# Altium schematic sheet MAX96724_PINOUT.SchDoc
size D; SheetNumber: 3; SheetTotal: 19
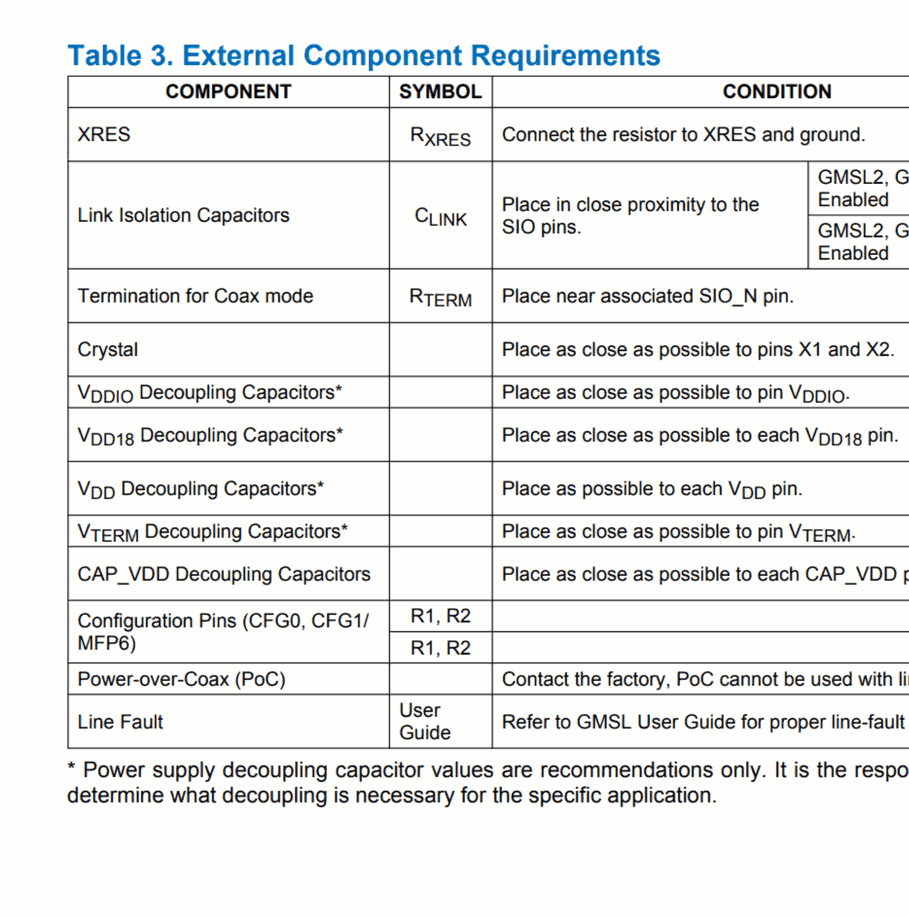
[diagram p0: MAX96724_PINOUT.SchDoc, top left]
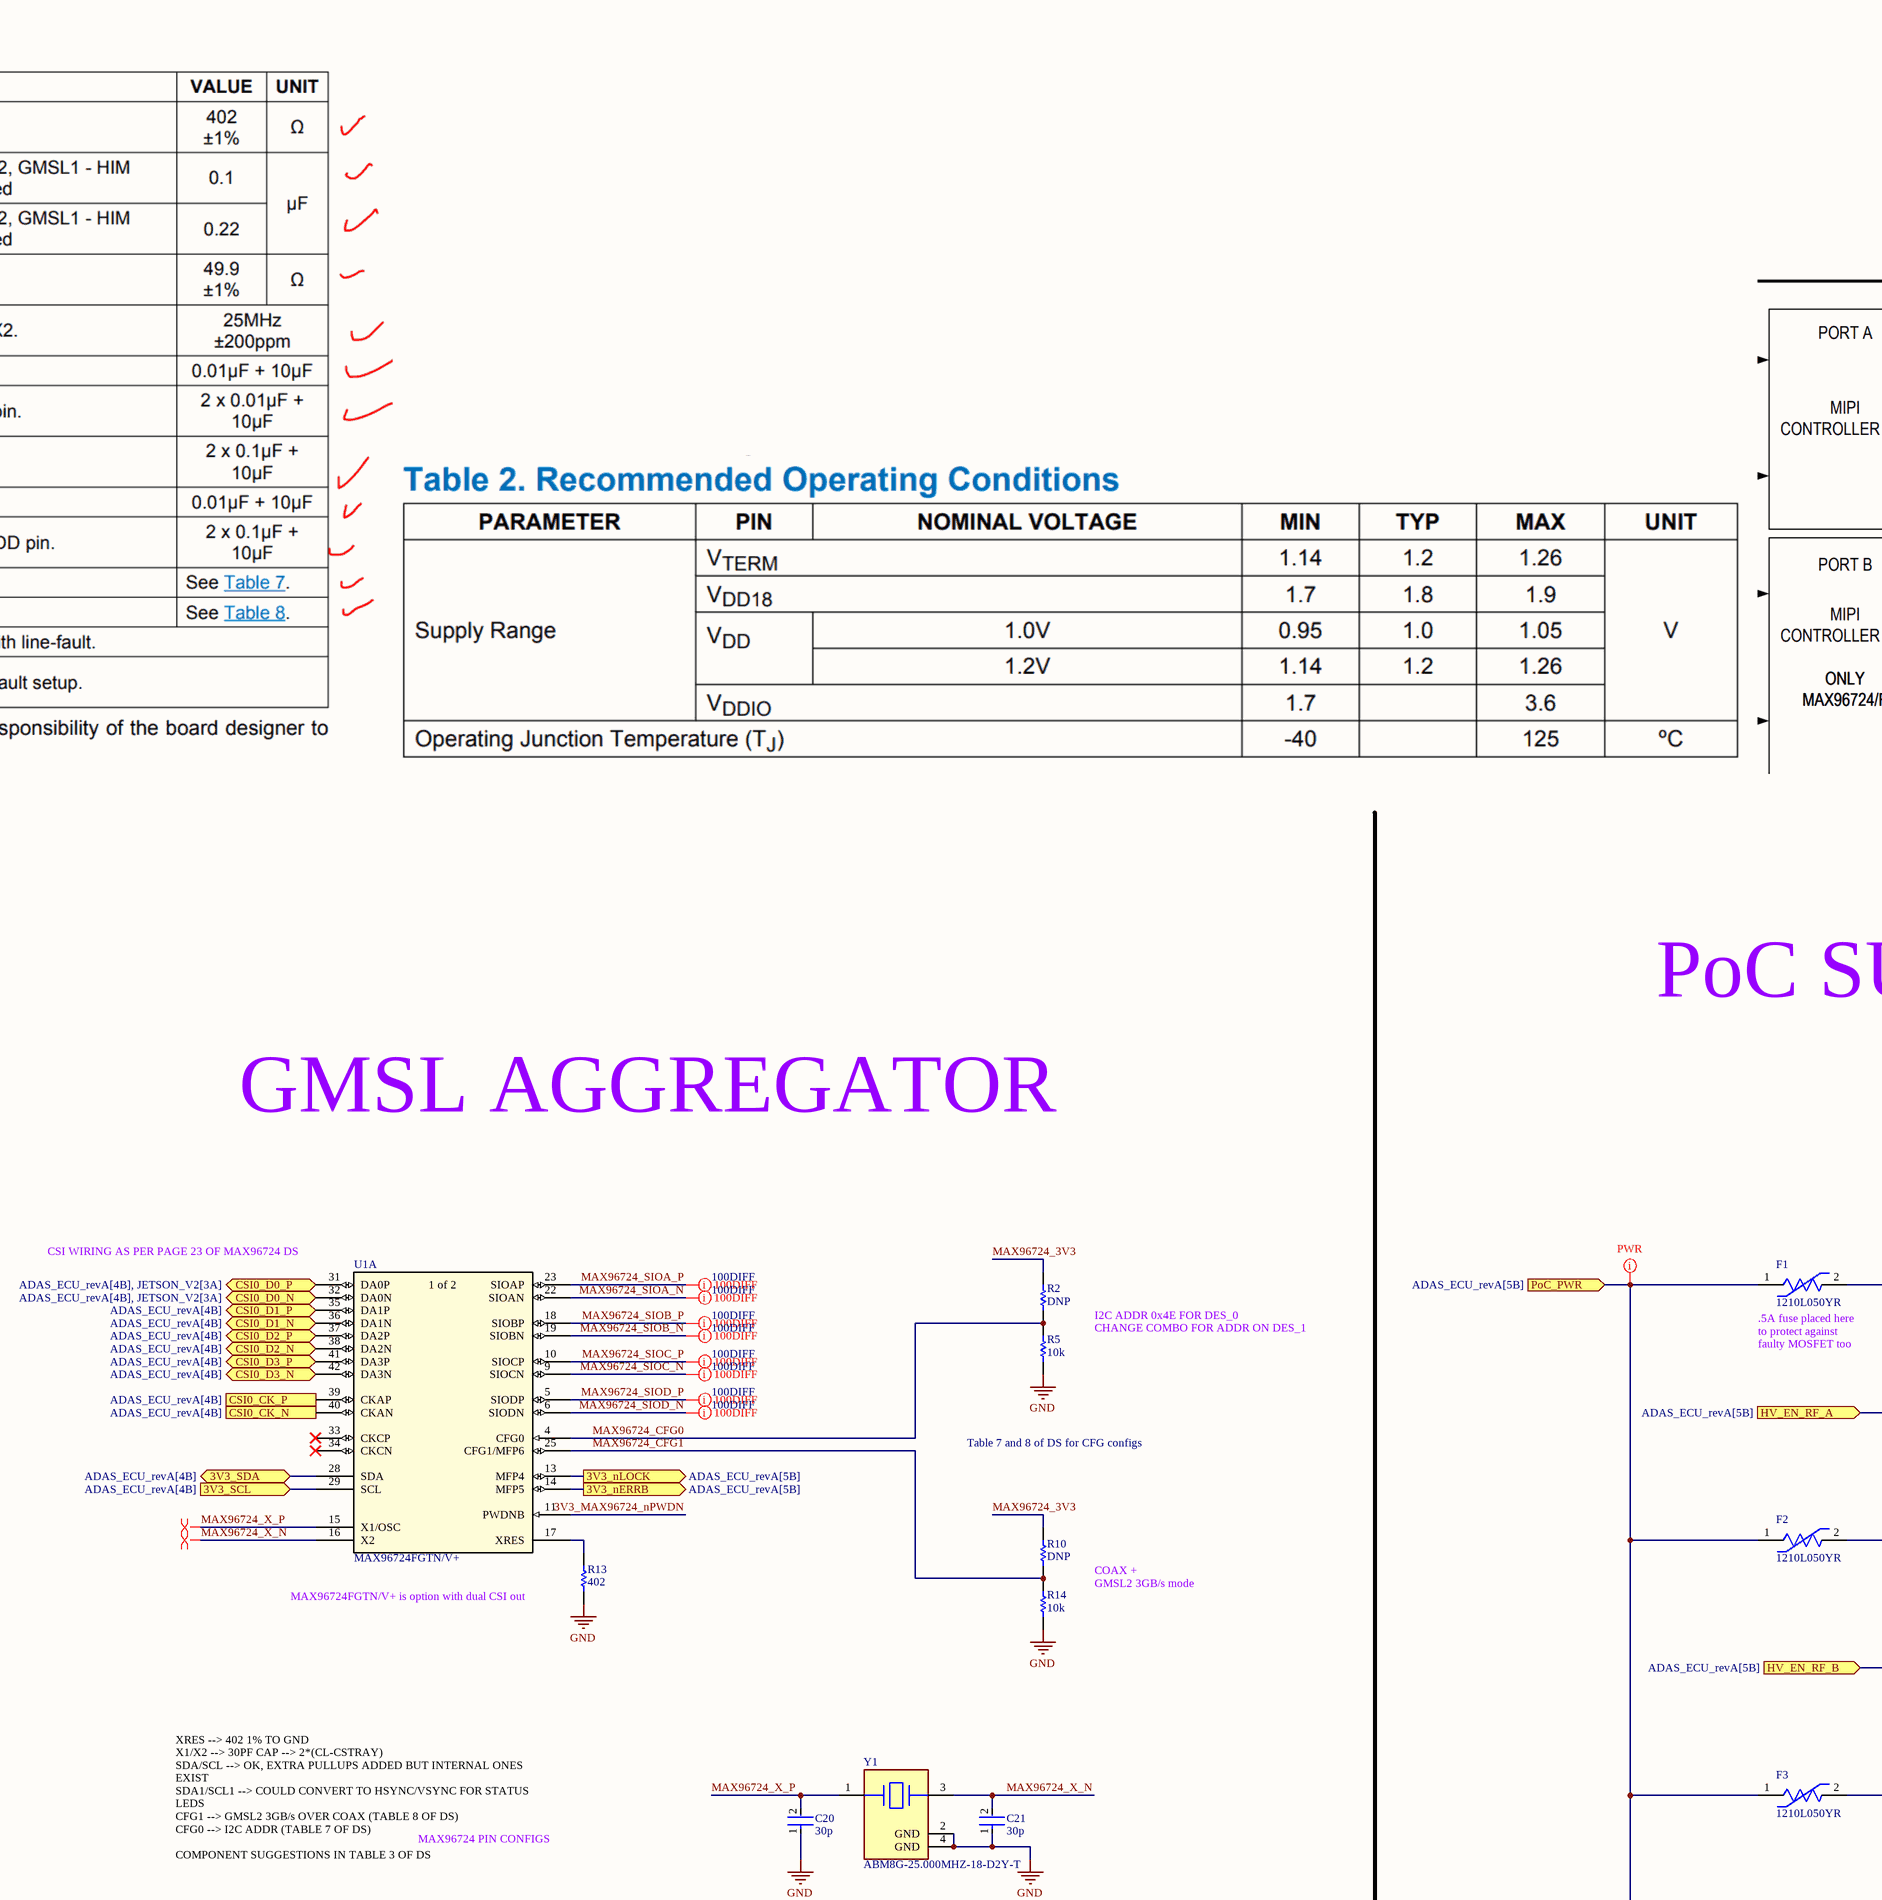
[diagram p1: MAX96724_PINOUT.SchDoc, top middle]
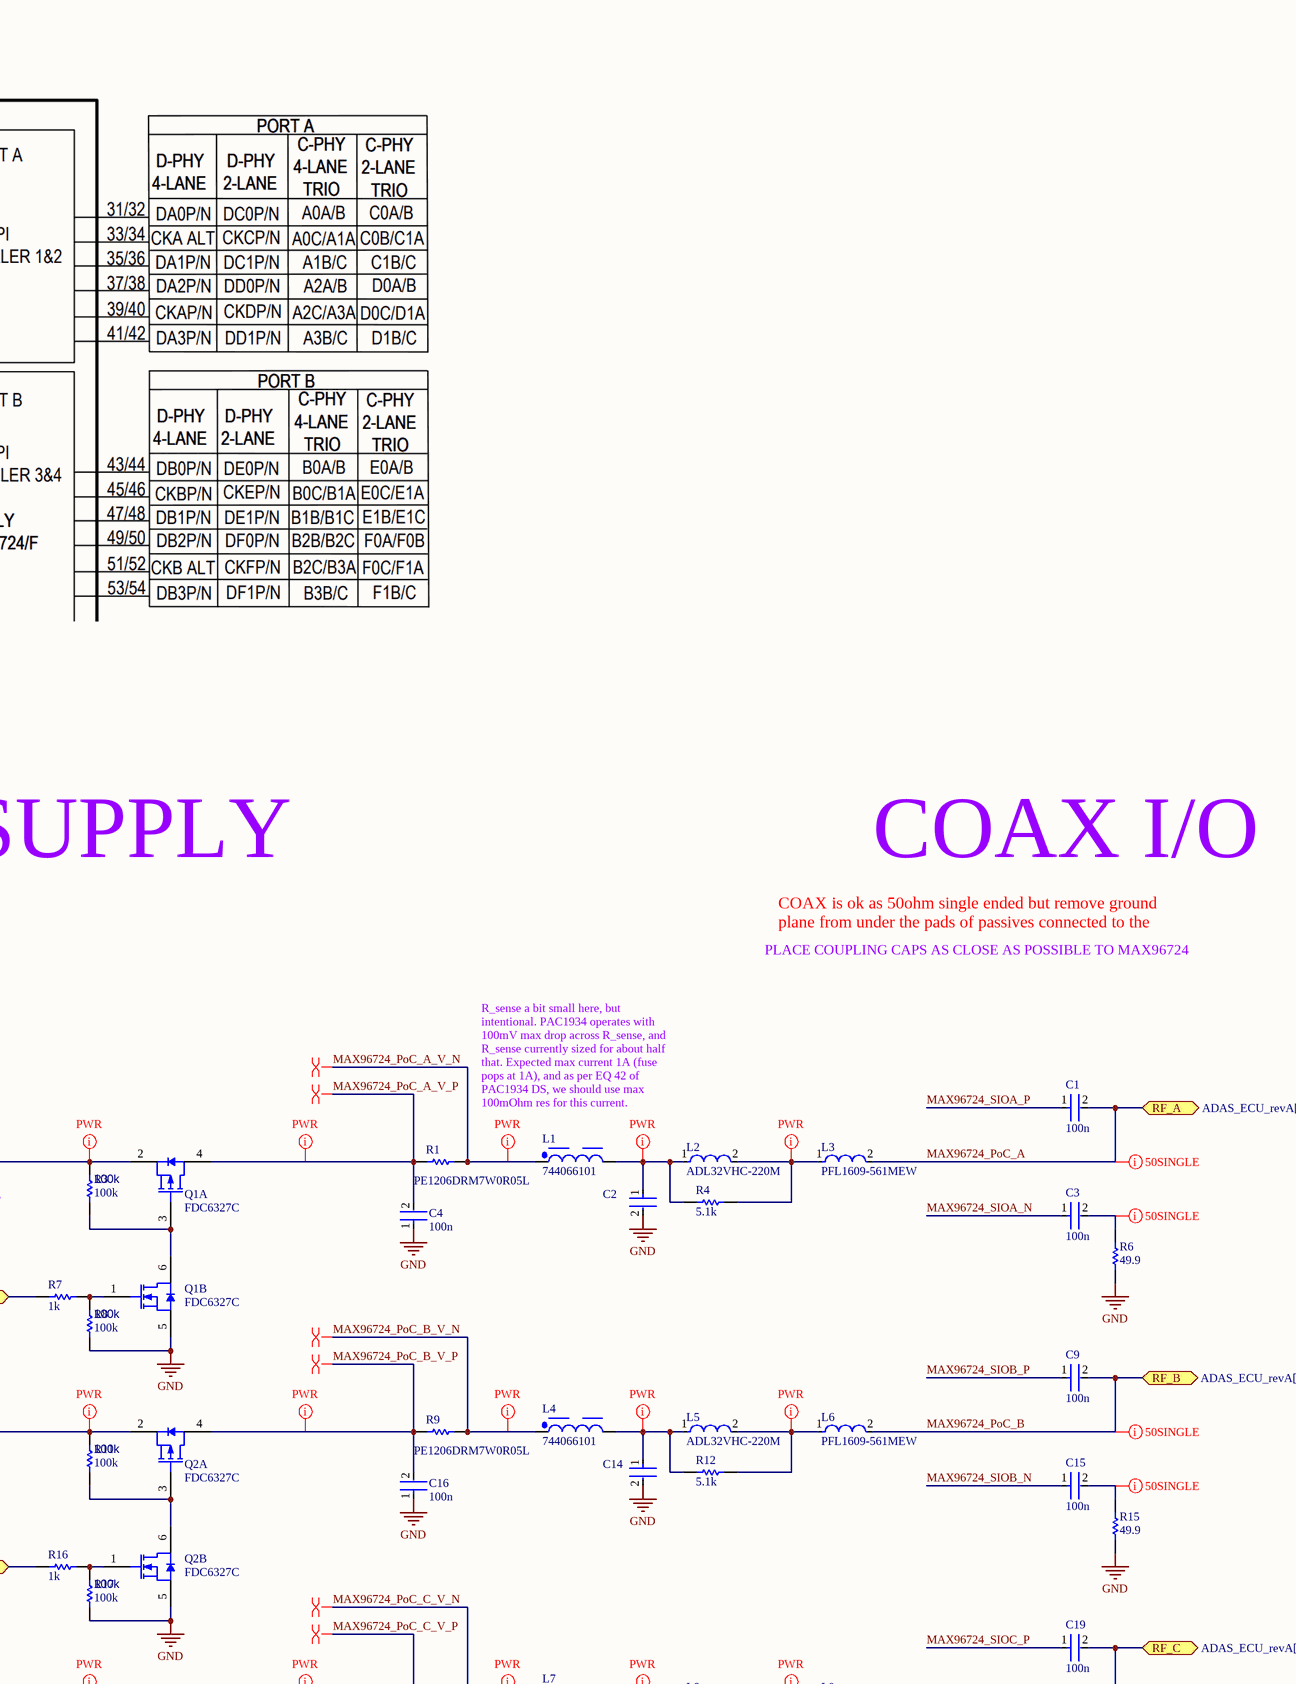
[diagram p2: MAX96724_PINOUT.SchDoc, top right]
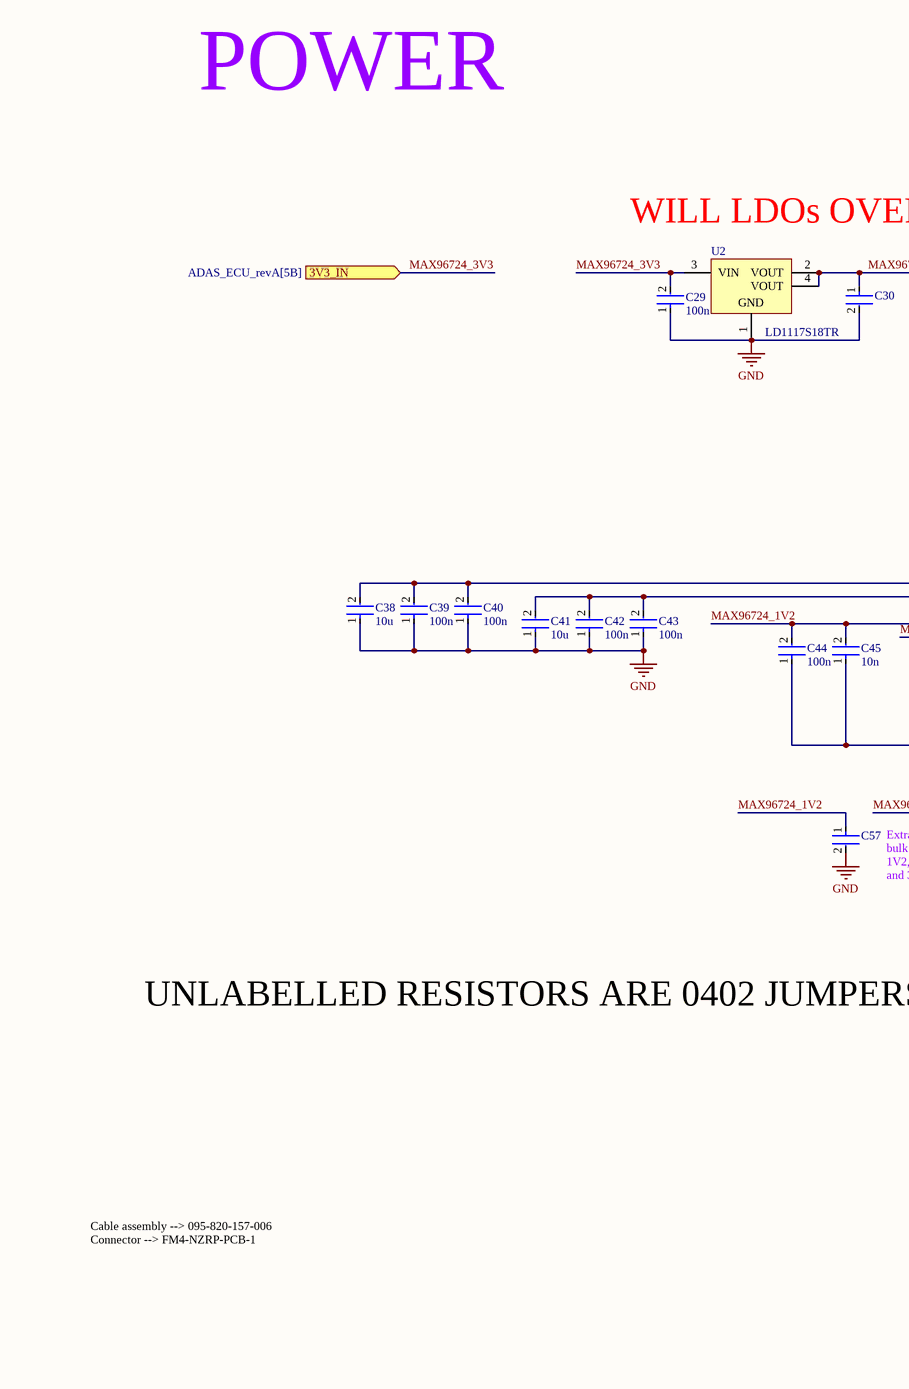
[diagram p3: MAX96724_PINOUT.SchDoc, bottom left]
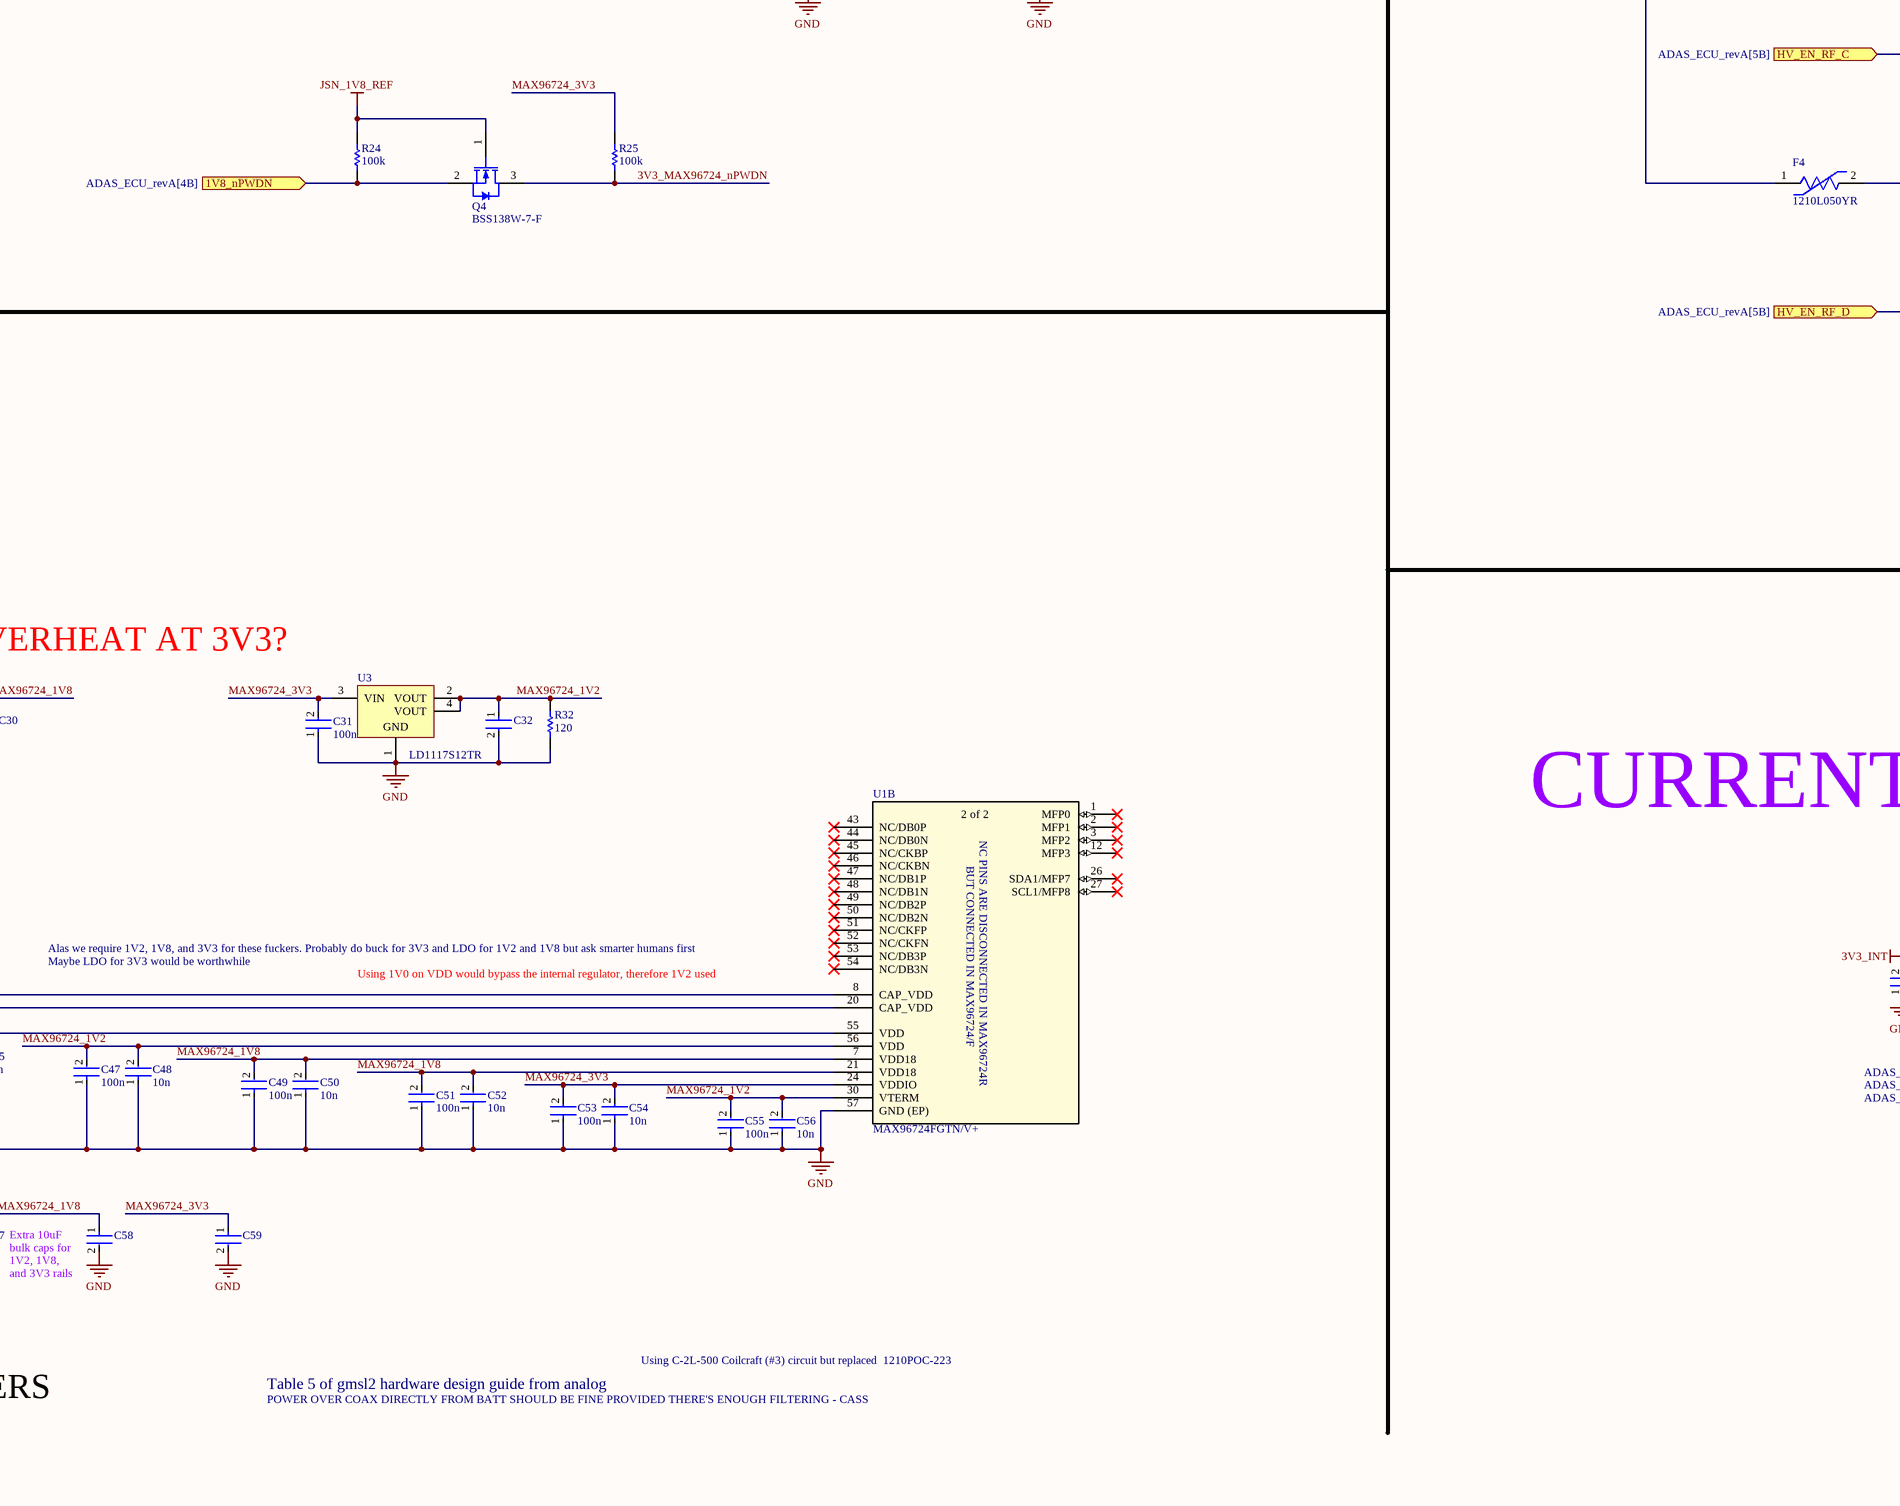
[diagram p4: MAX96724_PINOUT.SchDoc, bottom middle]
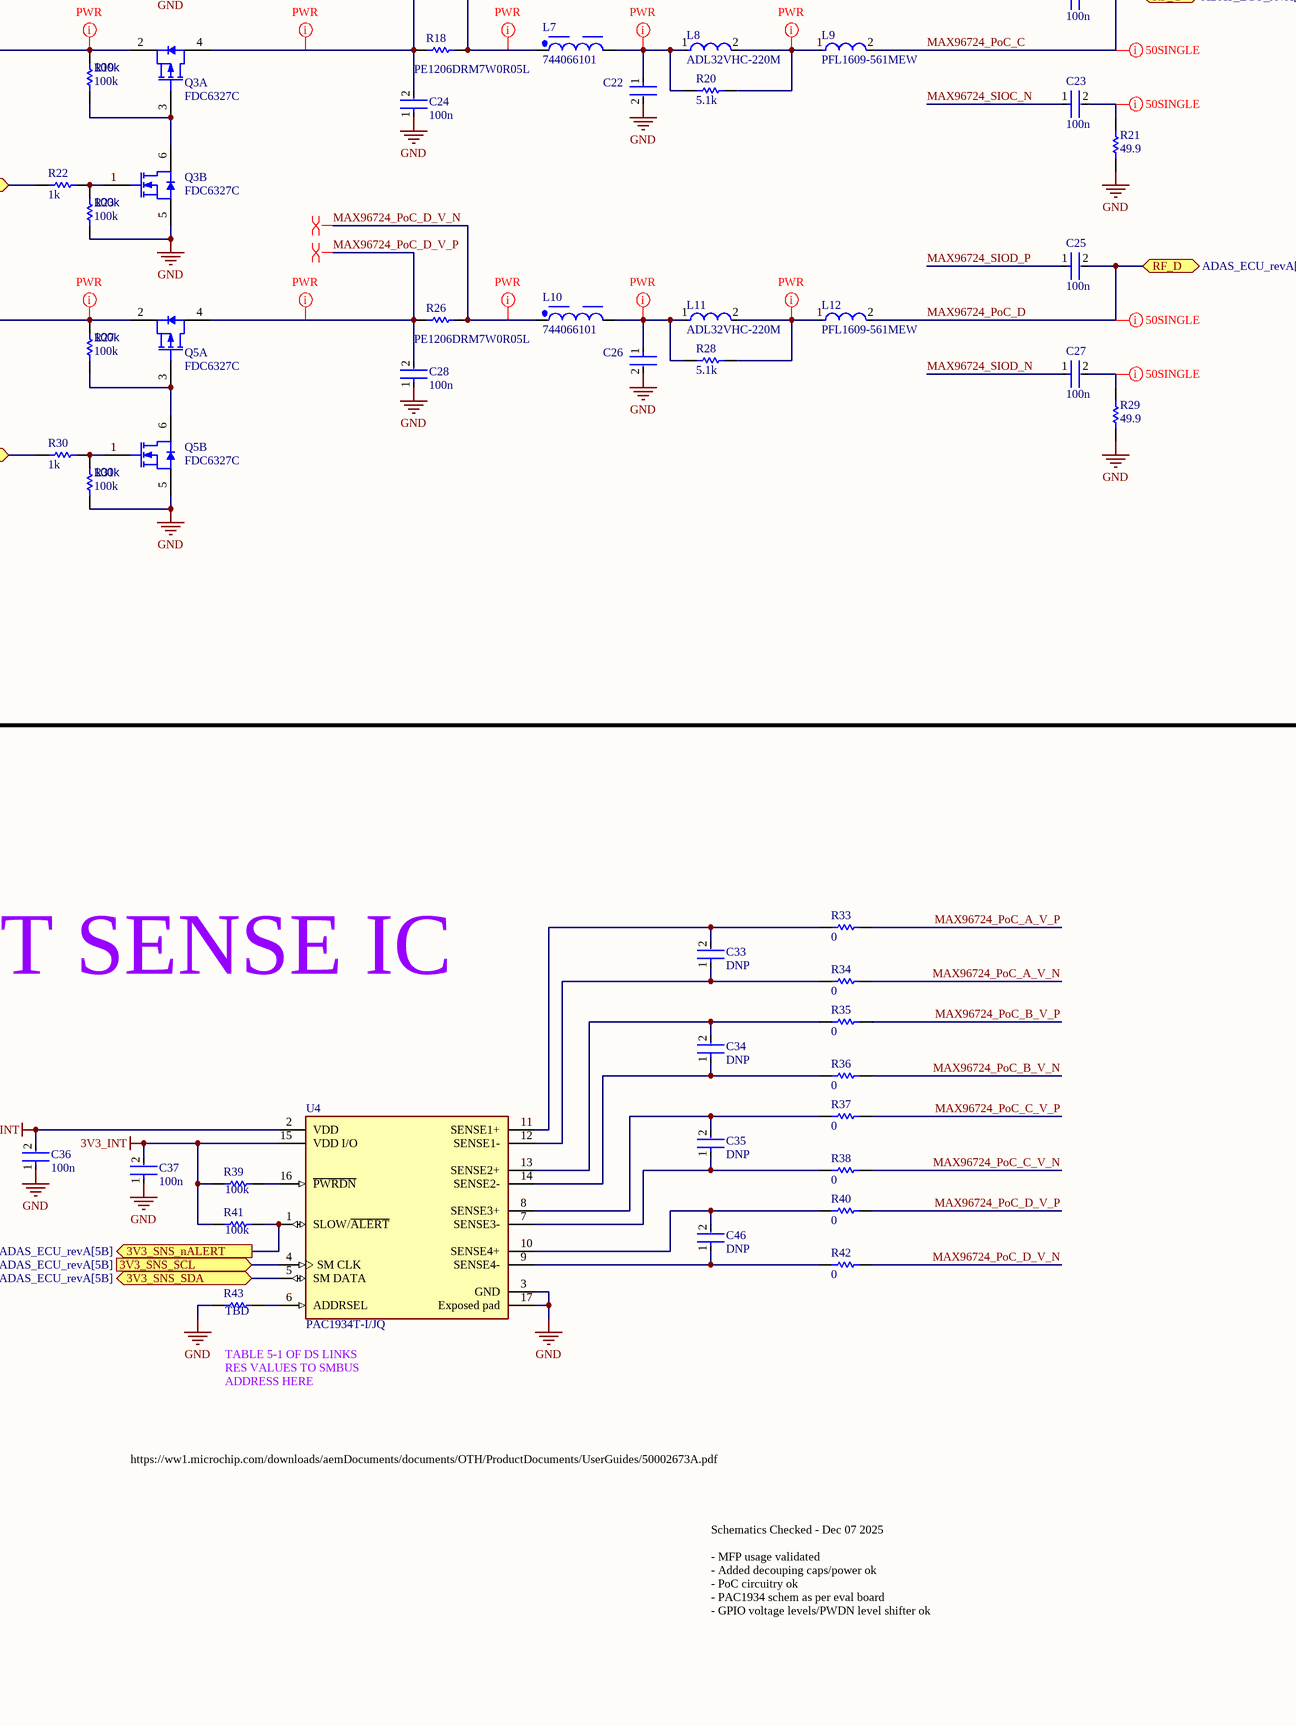
[diagram p5: MAX96724_PINOUT.SchDoc, bottom right]

## Parts
C1  100n  [FP-0402-L_1_0_0_05-W_0_5-IPC_A]
C2  GRM21BR61E226ME44L  [FP-GRM21B-0_2-e0_2_0_7-IPC_B]  (value not drawn)
C3  100n  [FP-0402-L_1_0_0_05-W_0_5-IPC_A]
C4  100n  [FP-0402-L_1_0_0_05-W_0_5-IPC_A]
C9  100n  [FP-0402-L_1_0_0_05-W_0_5-IPC_A]
C14  GRM21BR61E226ME44L  [FP-GRM21B-0_2-e0_2_0_7-IPC_B]  (value not drawn)
C15  100n  [FP-0402-L_1_0_0_05-W_0_5-IPC_A]
C16  100n  [FP-0402-L_1_0_0_05-W_0_5-IPC_A]
C19  100n  [FP-0402-L_1_0_0_05-W_0_5-IPC_A]
C20  30p  [FP-0402-L_1_0_0_05-W_0_5-IPC_A]
C21  30p  [FP-0402-L_1_0_0_05-W_0_5-IPC_A]
C22  GRM21BR61E226ME44L  [FP-GRM21B-0_2-e0_2_0_7-IPC_B]  (value not drawn)
C23  100n  [FP-0402-L_1_0_0_05-W_0_5-IPC_A]
C24  100n  [FP-0402-L_1_0_0_05-W_0_5-IPC_A]
C25  100n  [FP-0402-L_1_0_0_05-W_0_5-IPC_A]
C26  GRM21BR61E226ME44L  [FP-GRM21B-0_2-e0_2_0_7-IPC_B]  (value not drawn)
C27  100n  [FP-0402-L_1_0_0_05-W_0_5-IPC_A]
C28  100n  [FP-0402-L_1_0_0_05-W_0_5-IPC_A]
C29  100n  [FP-0402-L_1_0_0_05-W_0_5-IPC_A]
C30  GRM188R60J106ME47D  [FP-GRM188-0_1-e0_2_0_55-IPC_A]  (value not drawn)
C31  100n  [FP-0402-L_1_0_0_05-W_0_5-IPC_A]
C32  GRM188R60J106ME47D  [FP-GRM188-0_1-e0_2_0_55-IPC_A]  (value not drawn)
C33  DNP  [FP-0402-L_1_0_0_05-W_0_5-IPC_A]
C34  DNP  [FP-0402-L_1_0_0_05-W_0_5-IPC_A]
C35  DNP  [FP-0402-L_1_0_0_05-W_0_5-IPC_A]
C36  100n  [FP-0402-L_1_0_0_05-W_0_5-IPC_A]
C37  100n  [FP-0402-L_1_0_0_05-W_0_5-IPC_A]
C38  10u  [FP-0402-L_1_0_0_05-W_0_5-IPC_A]
C39  100n  [FP-0402-L_1_0_0_05-W_0_5-IPC_A]
C40  100n  [FP-0402-L_1_0_0_05-W_0_5-IPC_A]
C41  10u  [FP-0402-L_1_0_0_05-W_0_5-IPC_A]
C42  100n  [FP-0402-L_1_0_0_05-W_0_5-IPC_A]
C43  100n  [FP-0402-L_1_0_0_05-W_0_5-IPC_A]
C44  100n  [FP-0402-L_1_0_0_05-W_0_5-IPC_A]
C45  10n  [FP-0402-L_1_0_0_05-W_0_5-IPC_A]
C46  DNP  [FP-0402-L_1_0_0_05-W_0_5-IPC_A]
C47  100n  [FP-0402-L_1_0_0_05-W_0_5-IPC_A]
C48  10n  [FP-0402-L_1_0_0_05-W_0_5-IPC_A]
C49  100n  [FP-0402-L_1_0_0_05-W_0_5-IPC_A]
C50  10n  [FP-0402-L_1_0_0_05-W_0_5-IPC_A]
C51  100n  [FP-0402-L_1_0_0_05-W_0_5-IPC_A]
C52  10n  [FP-0402-L_1_0_0_05-W_0_5-IPC_A]
C53  100n  [FP-0402-L_1_0_0_05-W_0_5-IPC_A]
C54  10n  [FP-0402-L_1_0_0_05-W_0_5-IPC_A]
C55  100n  [FP-0402-L_1_0_0_05-W_0_5-IPC_A]
C56  10n  [FP-0402-L_1_0_0_05-W_0_5-IPC_A]
C57  EMK107BBJ106MA-T  [FP-0603-L_1_6_0_2-W_0_8_0-MFG]  (value not drawn)
C58  EMK107BBJ106MA-T  [FP-0603-L_1_6_0_2-W_0_8_0-MFG]  (value not drawn)
C59  EMK107BBJ106MA-T  [FP-0603-L_1_6_0_2-W_0_8_0-MFG]  (value not drawn)
F1  1210L050YR  [FP-1210L050YR-MFG]
F2  1210L050YR  [FP-1210L050YR-MFG]
F3  1210L050YR  [FP-1210L050YR-MFG]
F4  1210L050YR  [FP-1210L050YR-MFG]
L1  744066101  [WE-TPC_1038]
L2  ADL32VHC-220M  [FP-1210POC-MFG]
L3  PFL1609-561MEW  [FP-PFL1609-MFG]
L4  744066101  [WE-TPC_1038]
L5  ADL32VHC-220M  [FP-1210POC-MFG]
L6  PFL1609-561MEW  [FP-PFL1609-MFG]
L7  744066101  [WE-TPC_1038]
L8  ADL32VHC-220M  [FP-1210POC-MFG]
L9  PFL1609-561MEW  [FP-PFL1609-MFG]
L10  744066101  [WE-TPC_1038]
L11  ADL32VHC-220M  [FP-1210POC-MFG]
L12  PFL1609-561MEW  [FP-PFL1609-MFG]
Q1  FDC6327C  [FAIR-SOT23-6_V]  (parts A,B of 2)
Q2  FDC6327C  [FAIR-SOT23-6_V]  (parts A,B of 2)
Q3  FDC6327C  [FAIR-SOT23-6_V]  (parts A,B of 2)
Q4  BSS138W-7-F  [DIOD-SOT323-3_V]
Q5  FDC6327C  [FAIR-SOT23-6_V]  (parts A,B of 2)
R1  PE1206DRM7W0R05L  [R1206B]
R2  DNP  [R0603B]
R3  100k  [R0603B]
R4  5.1k  [R0603B]
R5  10k  [R0603B]
R6  49.9  [R0603B]
R7  1k  [R0603B]
R8  100k  [R0603B]
R9  PE1206DRM7W0R05L  [R1206B]
R10  DNP  [R0603B]
R11  100k  [R0603B]
R12  5.1k  [R0603B]
R13  402  [R0603B]
R14  10k  [R0603B]
R15  49.9  [R0603B]
R16  1k  [R0603B]
R17  100k  [R0603B]
R18  PE1206DRM7W0R05L  [R1206B]
R19  100k  [R0603B]
R20  5.1k  [R0603B]
R21  49.9  [R0603B]
R22  1k  [R0603B]
R23  100k  [R0603B]
R24  100k  [R0603B]
R25  100k  [R0603B]
R26  PE1206DRM7W0R05L  [R1206B]
R27  100k  [R0603B]
R28  5.1k  [R0603B]
R29  49.9  [R0603B]
R30  1k  [R0603B]
R31  100k  [R0603B]
R32  120  [R0603B]
R33  0  [R0603B]
R34  0  [R0603B]
R35  0  [R0603B]
R36  0  [R0603B]
R37  0  [R0603B]
R38  0  [R0603B]
R39  100k  [R0603B]
R40  0  [R0603B]
R41  100k  [R0603B]
R42  0  [R0603B]
R43  TBD  [R0603B]
U1  MAX96724FGTN/V+  [MAX96724FGTN_V+-Footprint-1]  (parts A,B of 2)
U2  LD1117S18TR  [SOT-223_M]
U3  LD1117S12TR  [SOT-223_M]
U4  PAC1934T-I/JQ  [FP-C04-257-MFG]
Y1  ABM8G-25.000MHZ-18-D2Y-T  [FP-ABM8G-MFG]

## Ports
1V8_nPWDN (in, see ADAS_ECU_revA[4B]), 3V3_IN (in, see ADAS_ECU_revA[5B]), 3V3_nERRB (out, see ADAS_ECU_revA[5B]), 3V3_nLOCK (out, see ADAS_ECU_revA[5B]), 3V3_SCL (in, see ADAS_ECU_revA[4B]), 3V3_SDA (bidir, see ADAS_ECU_revA[4B]), 3V3_SNS_nALERT (out, see ADAS_ECU_revA[5B]), 3V3_SNS_SCL (in, see ADAS_ECU_revA[5B]), 3V3_SNS_SDA (bidir, see ADAS_ECU_revA[5B]), CSI0_CK_N (in, see ADAS_ECU_revA[4B]), CSI0_CK_P (in, see ADAS_ECU_revA[4B]), CSI0_D0_N (bidir, see ADAS_ECU_revA[4B], JETSON_V2[3A]), CSI0_D0_P (bidir, see ADAS_ECU_revA[4B], JETSON_V2[3A]), CSI0_D1_N (bidir, see ADAS_ECU_revA[4B]), CSI0_D1_P (bidir, see ADAS_ECU_revA[4B]), CSI0_D2_N (bidir, see ADAS_ECU_revA[4B]), CSI0_D2_P (bidir, see ADAS_ECU_revA[4B]), CSI0_D3_N (bidir, see ADAS_ECU_revA[4B]), CSI0_D3_P (bidir, see ADAS_ECU_revA[4B]), HV_EN_RF_A (in, see ADAS_ECU_revA[5B]), HV_EN_RF_B (in, see ADAS_ECU_revA[5B]), HV_EN_RF_C (in, see ADAS_ECU_revA[5B]), HV_EN_RF_D (in, see ADAS_ECU_revA[5B]), PoC_PWR (in, see ADAS_ECU_revA[5B]), RF_A (bidir, see ADAS_ECU_revA[5B]), RF_B (bidir, see ADAS_ECU_revA[5B]), RF_C (bidir, see ADAS_ECU_revA[5B]), RF_D (bidir, see ADAS_ECU_revA[5B])

## Nets
3V3_INT: C36.2 C37.2 R39.2 R41.2 U4.2(VDD) U4.15(VDD_I/O)
GND: C2.2 C4.1 C14.2 C16.1 C20.1 C21.1 C22.2 C24.1 C26.2 C28.1 C29.1 C30.2 C31.1 C32.2 C36.1 C37.1 C38.1 C39.1 C40.1 C41.1 C42.1 C43.1 C44.1 C45.1 C47.1 C48.1 C49.1 C50.1 C51.1 C52.1 C53.1 C54.1 C55.1 C56.1 C57.2 C58.2 C59.2 Q1.5(S) Q2.5(S) Q3.5(S) Q5.5(S) R5.1 R6.1 R8.1 R13.1 R14.1 R15.1 R17.1 R21.1 R23.1 R29.1 R31.1 R32.1 R43.2 U1.57(GND_(EP)) U2.1(GND) U3.1(GND) U4.3(GND) U4.17(Exposed_pad) Y1.2(GND) Y1.4(GND)
JSN_1V8_REF: Q4.1(G) R24.2
1V8_nPWDN: Q4.2(S) R24.1 ; port 1V8_nPWDN
3V3_MAX96724_nPWDN: Q4.3(D) R25.1 U1.11(PWDNB)
3V3_nERRB: U1.14(MFP5) ; port 3V3_nERRB
3V3_nLOCK: U1.13(MFP4) ; port 3V3_nLOCK
3V3_SCL: U1.29(SCL) ; port 3V3_SCL
3V3_SDA: U1.28(SDA) ; port 3V3_SDA
3V3_SNS_nALERT: R41.1 U4.1(SLOW/~{ALERT}) ; port 3V3_SNS_nALERT
3V3_SNS_SCL: U4.4(SM_CLK) ; port 3V3_SNS_SCL
3V3_SNS_SDA: U4.5(SM_DATA) ; port 3V3_SNS_SDA
CSI0_CK_N: U1.40(CKAN) ; port CSI0_CK_N
CSI0_CK_P: U1.39(CKAP) ; port CSI0_CK_P
CSI0_D0_N: U1.32(DA0N) ; port CSI0_D0_N
CSI0_D0_P: U1.31(DA0P) ; port CSI0_D0_P
CSI0_D1_N: U1.36(DA1N) ; port CSI0_D1_N
CSI0_D1_P: U1.35(DA1P) ; port CSI0_D1_P
CSI0_D2_N: U1.38(DA2N) ; port CSI0_D2_N
CSI0_D2_P: U1.37(DA2P) ; port CSI0_D2_P
CSI0_D3_N: U1.42(DA3N) ; port CSI0_D3_N
CSI0_D3_P: U1.41(DA3P) ; port CSI0_D3_P
HV_EN_RF_A: R7.2 ; port HV_EN_RF_A
HV_EN_RF_B: R16.2 ; port HV_EN_RF_B
HV_EN_RF_C: R22.2 ; port HV_EN_RF_C
HV_EN_RF_D: R30.2 ; port HV_EN_RF_D
MAX96724_1V2: C32.1 C44.2 C45.2 C47.2 C48.2 C55.2 C56.2 C57.1 R32.2 U1.30(VTERM) U1.55(VDD) U1.56(VDD) U3.2(VOUT) U3.4(VOUT)
MAX96724_1V8: C30.1 C49.2 C50.2 C51.2 C52.2 C58.1 U1.7(VDD18) U1.21(VDD18) U2.2(VOUT) U2.4(VOUT)
MAX96724_3V3: C29.2 C31.2 C53.2 C54.2 C59.1 R2.2 R10.2 R25.2 U1.24(VDDIO) U2.3(VIN) U3.3(VIN) ; port 3V3_IN
MAX96724_CFG0: R2.1 R5.2 U1.4(CFG0)
MAX96724_CFG1: R10.1 R14.2 U1.25(CFG1/MFP6)
MAX96724_PoC_A: C1.2 L3.2 ; port RF_A
MAX96724_PoC_A_V_N: L1.1 R1.1 R34.1
MAX96724_PoC_A_V_P: C4.2 Q1.4(D) R1.2 R33.1
MAX96724_PoC_B: C9.2 L6.2 ; port RF_B
MAX96724_PoC_B_V_N: L4.1 R9.1 R36.1
MAX96724_PoC_B_V_P: C16.2 Q2.4(D) R9.2 R35.1
MAX96724_PoC_C: C19.2 L9.2 ; port RF_C
MAX96724_PoC_C_V_N: L7.1 R18.1 R38.1
MAX96724_PoC_C_V_P: C24.2 Q3.4(D) R18.2 R37.1
MAX96724_PoC_D: C25.2 L12.2 ; port RF_D
MAX96724_PoC_D_V_N: L10.1 R26.1 R42.1
MAX96724_PoC_D_V_P: C28.2 Q5.4(D) R26.2 R40.1
MAX96724_SIOA_N: C3.1 U1.22(SIOAN)
MAX96724_SIOA_P: C1.1 U1.23(SIOAP)
MAX96724_SIOB_N: C15.1 U1.19(SIOBN)
MAX96724_SIOB_P: C9.1 U1.18(SIOBP)
MAX96724_SIOC_N: C23.1 U1.9(SIOCN)
MAX96724_SIOC_P: C19.1 U1.10(SIOCP)
MAX96724_SIOD_N: C27.1 U1.6(SIODN)
MAX96724_SIOD_P: C25.1 U1.5(SIODP)
MAX96724_X_N: C21.2 U1.16(X2) Y1.3
MAX96724_X_P: C20.2 U1.15(X1/OSC) Y1.1
PoC_PWR: F1.1 F2.1 F3.1 F4.1 ; port PoC_PWR
NetC2_1: C2.1 L1.2 L2.1 R4.2
NetC3_2: C3.2 R6.2
NetC14_1: C14.1 L4.2 L5.1 R12.2
NetC15_2: C15.2 R15.2
NetC22_1: C22.1 L7.2 L8.1 R20.2
NetC23_2: C23.2 R21.2
NetC26_1: C26.1 L10.2 L11.1 R28.2
NetC27_2: C27.2 R29.2
NetC33_1: C33.1 R34.2 U4.12(SENSE1-)
NetC33_2: C33.2 R33.2 U4.11(SENSE1+)
NetC34_1: C34.1 R36.2 U4.14(SENSE2-)
NetC34_2: C34.2 R35.2 U4.13(SENSE2+)
NetC35_1: C35.1 R38.2 U4.7(SENSE3-)
NetC35_2: C35.2 R37.2 U4.8(SENSE3+)
NetC38_2: C38.2 C39.2 C40.2 U1.8(CAP_VDD)
NetC41_2: C41.2 C42.2 C43.2 U1.20(CAP_VDD)
NetC46_1: C46.1 R42.2 U4.9(SENSE4-)
NetC46_2: C46.2 R40.2 U4.10(SENSE4+)
NetF1_2: F1.2 Q1.2(S) R3.2
NetF2_2: F2.2 Q2.2(S) R11.2
NetF3_2: F3.2 Q3.2(S) R19.2
NetF4_2: F4.2 Q5.2(S) R27.2
NetL2_2: L2.2 L3.1 R4.1
NetL5_2: L5.2 L6.1 R12.1
NetL8_2: L8.2 L9.1 R20.1
NetL11_2: L11.2 L12.1 R28.1
NetQ1_1: Q1.1(G) R7.1 R8.2
NetQ1_3: Q1.3(G) Q1.6(D) R3.1
NetQ2_1: Q2.1(G) R16.1 R17.2
NetQ2_3: Q2.3(G) Q2.6(D) R11.1
NetQ3_1: Q3.1(G) R22.1 R23.2
NetQ3_3: Q3.3(G) Q3.6(D) R19.1
NetQ5_1: Q5.1(G) R30.1 R31.2
NetQ5_3: Q5.3(G) Q5.6(D) R27.1
NetR13_2: R13.2 U1.17(XRES)
NetR39_1: R39.1 U4.16(~{PWRDN})
NetR43_1: R43.1 U4.6(ADDRSEL)

Not connected (* = marked no-connect by the designer): U1 1(MFP0)* 2(MFP1)* 3(MFP2)* 12(MFP3)* 26(SDA1/MFP7)* 27(SCL1/MFP8)* 33(CKCP)* 34(CKCN)* 43(NC/DB0P)* 44(NC/DB0N)* 45(NC/CKBP)* 46(NC/CKBN)* 47(NC/DB1P)* 48(NC/DB1N)* 49(NC/DB2P)* 50(NC/DB2N)* 51(NC/CKFP)* 52(NC/CKFN)* 53(NC/DB3P)* 54(NC/DB3N)*

## Layout directives
net class 50SINGLE: MAX96724_PoC_A, MAX96724_PoC_B, MAX96724_PoC_C, MAX96724_PoC_D, NetC3_2, NetC15_2, NetC23_2, NetC27_2
differential pair: MAX96724_PoC_A_V_N, MAX96724_PoC_A_V_P, MAX96724_PoC_B_V_N, MAX96724_PoC_B_V_P, MAX96724_PoC_C_V_N, MAX96724_PoC_C_V_P, MAX96724_PoC_D_V_N, MAX96724_PoC_D_V_P, MAX96724_X_N, MAX96724_X_P
net class PWR: MAX96724_PoC_A_V_N, MAX96724_PoC_A_V_P, MAX96724_PoC_B_V_N, MAX96724_PoC_B_V_P, MAX96724_PoC_C_V_N, MAX96724_PoC_C_V_P, MAX96724_PoC_D_V_N, MAX96724_PoC_D_V_P, NetC2_1, NetC14_1, NetC22_1, NetC26_1, NetF1_2, NetF2_2, NetF3_2, NetF4_2, NetL2_2, NetL5_2, NetL8_2, NetL11_2, PoC_PWR
differential pair; differential pair class 100DIFF: MAX96724_SIOA_N, MAX96724_SIOA_P, MAX96724_SIOB_N, MAX96724_SIOB_P, MAX96724_SIOC_N, MAX96724_SIOC_P, MAX96724_SIOD_N, MAX96724_SIOD_P

## Notes on the sheet
- PoC SUPPLY
- COAX I/O
- PLACE COUPLING CAPS AS CLOSE AS POSSIBLE TO MAX96724
- COAX is ok as 50ohm single ended but remove ground plane from under the pads of passives connected to the GMSL trace
- GMSL AGGREGATOR
- R_sense a bit small here, but intentional. PAC1934 operates with 100mV max drop across R_sense, and R_sense currently sized for about half that. Expected max current 1A (fuse pops at 1A), and as per EQ 42 of PAC1934 DS, we should use max 100mOhm res for this current.
- CSI WIRING AS PER PAGE 23 OF MAX96724 DS
- I2C ADDR 0x4E FOR DES_0
- CHANGE COMBO FOR ADDR ON DES_1
- (near F1) .5A fuse placed here to protect against faulty MOSFET too
- Table 7 and 8 of DS for CFG configs
- MAX96724FGTN/V+ is option with dual CSI out
- GMSL2 3GB/s mode
- COAX +
- XRES --> 402 1% TO GND
  X1/X2 --> 30PF CAP --> 2*(CL-CSTRAY)
  SDA/SCL --> OK, EXTRA PULLUPS ADDED BUT INTERNAL ONES EXIST
  SDA1/SCL1 --> COULD CONVERT TO HSYNC/VSYNC FOR STATUS LEDS
  CFG1 --> GMSL2 3GB/s OVER COAX (TABLE 8 OF DS)
  CFG0 --> I2C ADDR (TABLE 7 OF DS)
  COMPONENT SUGGESTIONS IN TABLE 3 OF DS
  - DECOUPLING CAPS OK
- MAX96724 PIN CONFIGS
- POWER
- WILL LDOs OVERHEAT AT 3V3?
- CURRENT SENSE IC
- Alas we require 1V2, 1V8, and 3V3 for these fuckers. Probably do buck for 3V3 and LDO for 1V2 and 1V8 but ask smarter humans first
- Maybe LDO for 3V3 would be worthwhile
- Using 1V0 on VDD would bypass the internal regulator, therefore 1V2 used
- TABLE 5-1 OF DS LINKS RES VALUES TO SMBUS ADDRESS HERE
- Extra 10uF bulk caps for 1V2, 1V8, and 3V3 rails
- https://ww1.microchip.com/downloads/aemDocuments/documents/OTH/ProductDocuments/UserGuides/50002673A.pdf
- Using C-2L-500 Coilcraft (#3) circuit but replaced  1210POC-223
- UNLABELLED RESISTORS ARE 0402 JUMPERS
- Table 5 of gmsl2 hardware design guide from analog
- POWER OVER COAX DIRECTLY FROM BATT SHOULD BE FINE PROVIDED THERE'S ENOUGH FILTERING - CASS
- Schematics Checked - Dec 07 2025
  - MFP usage validated
  - Added decouping caps/power ok
  - PoC circuitry ok
  - PAC1934 schem as per eval board
  - GPIO voltage levels/PWDN level shifter ok
- Cable assembly --> 095-820-157-006
  Connector --> FM4-NZRP-PCB-1
- (in symbol CMP-015-00011-4, part A) 1 of 2
- (in symbol CMP-015-00011-4, part B) 2 of 2; NC PINS ARE DISCONNECTED IN MAX96724R; BUT CONNECTED IN MAX96724/F

## Library data of the parts
C1 C3 C4 C9 C15 C16 C19-C21 C23-C25 C27-C29 C31 C33-C56 = CMP-001-00058-1: LARGE PADS, 0402 CAP, CHANGE COMMENT TO MATCH REAL P/N; Capacitor Type: Ceramic; Min Operating Temperature: -55°C; Mounting Technology: Surface Mount; Pins: 2; Case/Package: 0402; RoHS Compliant: Yes; Max Operating Temperature: 85°C
C2 C14 C22 C26 = CMP-2007-03222-3: Chip Multilayer Ceramic Capacitors for General Purpose, 0805, 22uF, X5R, 15%, 20%, 25V; Case/Package: 0805; Depth: 1.25mm; Resistor Type: Ceramic; Voltage Rating: 25V; Lead Free: Lead Free; Voltage Rating (DC): 25V; Case Code (Metric): 2012; Thickness: 0.057inch; REACH SVHC: No SVHC; Material: Ceramic; Tolerance: 20%; Length: 2mm; Capacitance: 22uF; Case Code (Imperial): 0805; Max Operating Temperature: 85°C; Termination: SMD/SMT; Weight: 0.000335oz; Dielectric: X5R; Packaging: Tape and Reel; Voltage: 25V; Package Quantity: 3000; Height: 1.25mm; Mount: Surface Mount; Width: 1.25mm; Min Operating Temperature: -55°C
C30 C32 = CMP-2006-02792-2: Chip Multilayer Ceramic Capacitors for General Purpose, 0603, 10uF, X5R, 15%, 20%, 6.3V; Packaging: Tape and Reel; Voltage Rating (DC): 6.3V; Width: 0.031inch; Termination: SMD/SMT; Dielectric: X5R; Package Quantity: 4000; Voltage Rating: 6.3V; Capacitance: 10uF; Case/Package: 0603; Min Operating Temperature: -55°C; Voltage: 6.3V; Length: 1.6mm; Thickness: 0.035inch; Lead Free: Lead Free; Depth: 0.8mm; Case Code (Imperial): 0603; Max Operating Temperature: 85°C; Material: Ceramic; Height: 0.8mm; Tolerance: 20%; Mount: Surface Mount; REACH SVHC: No SVHC; Radiation Hardening: No; Case Code (Metric): 1608
C57-C59 = CMP-2000-06226-4: Multilayer Ceramic Capacitor 10uF 16V X5R 20% SMD 0603 T/R; Packaging: Tape and Reel; Construction: Flat; Height: 0.8mm; Max Operating Temperature: 85°C; Dielectric: X5R; Case Code (Metric): 1608; Voltage Rating (DC): 16V; Width: 0.031inch; Voltage Rating: 16V; Length: 0.063inch; RoHS Compliant: Yes; Halogen Free: Halogen Free; Case Code (Imperial): 0603; Capacitance: 10uF; Mount: Surface Mount; Thickness: 0.031inch; Tolerance: 20%; Min Operating Temperature: -55°C; Series: M; Termination: SMD/SMT; Case/Package: 0603; Package Quantity: 1
F1-F4 = CMP-08606-000067-1: PTC RESET FUSE 13.2V 500MA 1210; Approvals: cULus; Resistance: 900mR; Time to Trip: 0.1s; Max Current Rating: 100A; Trip Current: 1A; Max Power Dissipation: 600mW; Case Code (Metric): 3225; Min Operating Temperature: -40°C; Max Voltage Rating (DC): 13.2V; Hold Current: 500mA; Working Voltage: 13.2V; Termination: SMD/SMT; Case Code (Imperial): 1210; Current Rating: 100A; REACH SVHC: No SVHC; Width: 2.8mm; Lead Free: Lead Free; Length: 3.43mm; Voltage Rating (DC): 13.2V; Packaging: Tape and Reel; Terminal Material: Copper; Voltage Rating: 13.2V; Height: 0.85mm; Case/Package: 1210; Package Quantity: 4000; Max Operating Temperature: 85°C; Power Dissipation: 600mW; Operating Supply Voltage: 13.2V
L1 L4 L7 L10 = CMP-0227-00094-3: NexarPartId: 8917123; Current Rating: 1.2A; Shielding: Shielded; Core Material: Ferrite; Inductance: 100µH; Test Frequency: 100kHz; Tolerance: 30%; Resistance: 255mΩ; Self Resonant Frequency: 6MHz; Composition: Wirewound; Packaging: Cut Tape (CT); REACH SVHC: Unknown; Number of Pins: 2; Max DC Current: 1.2A; Saturation Current: 1.2A; Ambient Temperature Range High: 95°C; Weight: 1.273007g; Height: 3.8mm; Width: 10mm; Min Operating Temperature: -40°C; Max Operating Temperature: 125°C; Termination: SMD/SMT; Height - Seated (Max): 4.0894mm; Length: 10mm; RMS Current (Irms): 1.2A; Ambient Temperature Range Low: -40°C; RoHS: Compliant; Mount: Surface Mount; Depth: 10mm; DC Resistance (DCR): 255mΩ; Inductance Tolerance: 30%; Case/Package: Nonstandard
L2 L5 L8 L11 = CMP-11268-000041-1: NOT COILCRAFT - ACTUAL P# --> ADL32VHC-220M / - Power Injection Chokes for PoC; Manufacturer Part Number: 1210POC-223MRC; Value: 22uH; Core Material: Ferrite; Saturation Current: 720mA; Series Resistance: 0.88Ω; Rms Current: 700mA; Automotive Grade: Grade 1; Self Resonant Frequency: 70MHz; Test Frequency: 100kHz; Tolerance: 20%; Ambient Temperature Range High: +125°C; Manufacturer: coilcraft; Octopart: https://octopart.com/1210poc-223mrc-coilcraft-103207315; Category: Ind; Device Class L2: Inductors; RoHS: TRUE; Device Class L3: Fixed Inductors; Package: 1210POC; Ambient Temperature Range Low: -40°C; ComponentLink2URL: https://drive.google.com/open?id=15FlOq8Y4YbRFohfA_cJ40jgnqs8va2Mh; Lead Free: Yes; Inductance: 22uH; Device Class L1: Passive Components; ComponentLink2Description: Datasheet; Automotive: Yes; Height: 3mm
L3 L6 L9 L12 = CMP-11268-000007-1: Fixed Inductors PFL1609 Low Profile 0.56 uH 20 % 1.4 A; Manufacturer: coilcraft; Rms Current: 1100mA; Self Resonant Frequency: 600MHz; Core Material: Composite; Tolerance: 20%; Value: 0.56uH; Automotive Grade: Grade 1; Saturation Current: 710mA; Test Frequency: 7.9MHz; Shielding: true; Series Resistance: 130mΩ; Lead Free: Yes; Device Class L1: Passive Components; Package: PFL1609; Octopart: https://octopart.com/pfl1609-561mew-coilcraft-20329171; ComponentLink2URL: https://www.coilcraft.com/pdfs/pfl1609.pdf; Manufacturer Part Number: PFL1609-561MEW; Ambient Temperature Range Low: -40°C; Composition: Wirewound; Inductance: 0.56uH; Device Class L2: Inductors; Category: Ind; Device Class L3: Fixed Inductors; Mouser Description: Fixed Inductors PFL1609 Low Profile 0.56 uH 20 % 1.4 A; Automotive: Yes; ComponentLink2Description: Datasheet; Ambient Temperature Range High: +105°C; Height: 0.95mm; RoHS: TRUE
Q1-Q3 Q5 = CMP-2000-04939-1: Dual N & P-Channel 2.5 V Specified PowerTrench(TM) MOSFET, -55 to 150 degC, 6-Pin SOT-23, RoHS, Tape and Reel; Manufacturer: Fairchild; Typical Rise Time: 9@NChannel; Rad Hard: No; Maximum Drain Source Voltage: 20V; Typical Fall Time: 3@NChannel; Typical Turn-On Delay Time: 5@NChannel; Maximum Continuous Drain Current: 2.7@NChannel; Typical Turn-Off Delay Time: 12@NChannel; RDS-on: 80@4.5V@NChannel; Channel Mode: Enhancement; Maximum Gate Source Voltage: ±8V; Package Version: Rev. 5, 05/2015; Operating Temperature: -55to150degC; Packaging: Tape&Reel; Package Reference: SOT23-6; Package URL: https://www.fairchildsemi.com/package-drawings/MA/MA06A.pdf; Package Description: 6-Pin Small Outline Transistor, Body 2.9 x 1.6 mm, Pitch 0.95 mm; Manufacturer URL: https://www.fairchildsemi.com/; Channel Type: N; Datasheet Version: Rev. E, 07/2000; Package: 6SuperSOT; Datasheet URL: https://www.fairchildsemi.com/datasheets/FD/FDC6327C.pdf; Mounting: SurfaceMount; Category: MOSFET
Q4 = CMP-2000-05968-1: N-Channel Enhancement Mode Mosfet, 50 V, 200 mA, -55 to 150 degC, 6-Pin SOT-323, RoHS, Tape and Reel; Typical Turn-Off Delay Time: 20ns; Number of Channels: 1Channel; Type: EnhancementModeFieldEffectTransistor; Brand: DiodesIncorporated; Vds - Drain-Source Breakdown Voltage: 75V; Vgs - Gate-Source Voltage: 20V; Rds On - Drain-Source Resistance: 1.4Ohms; Transistor Type: 1N-Channel; Configuration: Single; Unit Weight: 0.000212oz; Pd - Power Dissipation: 200mW; Id - Continuous Drain Current: 200mA; Forward Transconductance - Min: 0.1S; Manufacturer URL: http://www.diodes.com/; Series: BSS138; Package Description: 3-Pin Small Outline Transistor, Body 2 x 1.25 mm, Pitch 0.65 mm; Mounting Technology: SurfaceMount; Product Category: MOSFET; RoHS: True; Maximum Operating Temperature: +150C; Height: 1mm; Length: 2.2mm; Technology: Si; Width: 1.35mm; Datasheet URL: http://www.diodes.com/_files/datasheets/ds30206.pdf; Manufacturer: DiodesIncorporated; Package / Case: SOT-323-3; Typical Turn-On Delay Time: 20ns; Transistor Polarity: N-Channel; Factory Pack Quantity: 3000; Packaging: Reel; Product: MOSFETSmallSignal; Datasheet Version: Rev. 11-2, 09/2013; Package Reference: SOT323; Minimum Operating Temperature: -55C; Mounting Style: SMD/SMT; Channel Mode: Enhancement
R1 R9 R18 R26 = CMP-009-00002-14: Value: 100k
R2-R8 R10-R17 R19-R25 R27-R42 = CMP-009-00002-14: Resistor
  R3 R8 R11 R17 R19 R23 R27 R31 R39 R41: Value: 100k
  R33-R38 R40 R42: Value: 0
R43 = CMP-009-00002-14: Resistor; Value: 100k
U1 = CMP-015-00011-4: Quad Tunneling GMSL2/1 to CSI-2 Deserializer
U2 = CMP-0244-00308-1: Fixed Low Drop Positive Voltage Regulator, 1.8V, 4-Pin SOT-223, Tape and Reel; ComponentLink1URL: http://www.st.com; PackageReference: SOT-223; PackageDescription: 4-Pin SOT-223 Package, 6.5 x 3.5 mm Body, 2.3 mm Pitch, 7 mm Lead Span; ComponentLink2URL: http://www.st.com/internet/com/TECHNICAL_RESOURCES/TECHNICAL_LITERATURE/DATASHEET/CD00000544.pdf; ComponentLink2Description: Datasheet; ComponentLink1Description: Manufacturer URL; DatasheetVersion: 1/11/2011; PackageVersion: 2010
U3 = CMP-0244-00318-1: Fixed Low Drop Positive Voltage Regulator, 1.2V, 4-Pin SOT-223, Tape and Reel; PackageDescription: 4-Pin SOT-223 Package, 6.5 x 3.5 mm Body, 2.3 mm Pitch, 7 mm Lead Span; PackageVersion: 2010; ComponentLink2Description: Datasheet; PackageReference: SOT-223; ComponentLink2URL: http://www.st.com/internet/com/TECHNICAL_RESOURCES/TECHNICAL_LITERATURE/DATASHEET/CD00000544.pdf; ComponentLink1Description: Manufacturer URL; DatasheetVersion: 1/11/2011; ComponentLink1URL: http://www.st.com
U4 = CMP-06317-000025-1: QUAD HIGH-SIDE CURRENT SENSOR; Accuracy: 1%; Min Operating Temperature: -40°C; Mount: Surface Mount; Max Operating Temperature: 85°C; Packaging: Cut Tape; RoHS Compliant: No
Y1 = CMP-2000-05733-3: Crystal 25MHz ±20ppm (Tol) ±30ppm (Stability) 18pF FUND 60Ω 4-Pin SMD T/R; Series Resistance: 60R; Length: 3.2mm; Depth: 2.5mm; Packaging: Tape and Reel; Min Operating Temperature: -40°C; Operating Frequency: 25 MHz; Lead Free: Lead Free; Number of Pins: 4; Frequency Tolerance: 20ppm; Radiation Hardening: No; Max Operating Temperature: 85°C; Termination: SMD/SMT; Frequency Stability: 30ppm; Frequency: 25MHz; Series: ABM8G; Mount: Surface Mount; Package Quantity: 1000; Height: 0.039inch; Width: 0.098inch; Case/Package: CSMD; ESR (Equivalent Series Resistance): 60R; Load Capacitance: 18pF; Tolerance: 20ppm